# EAGLE schematic New Pendant wiring (EAGLE 6.4)
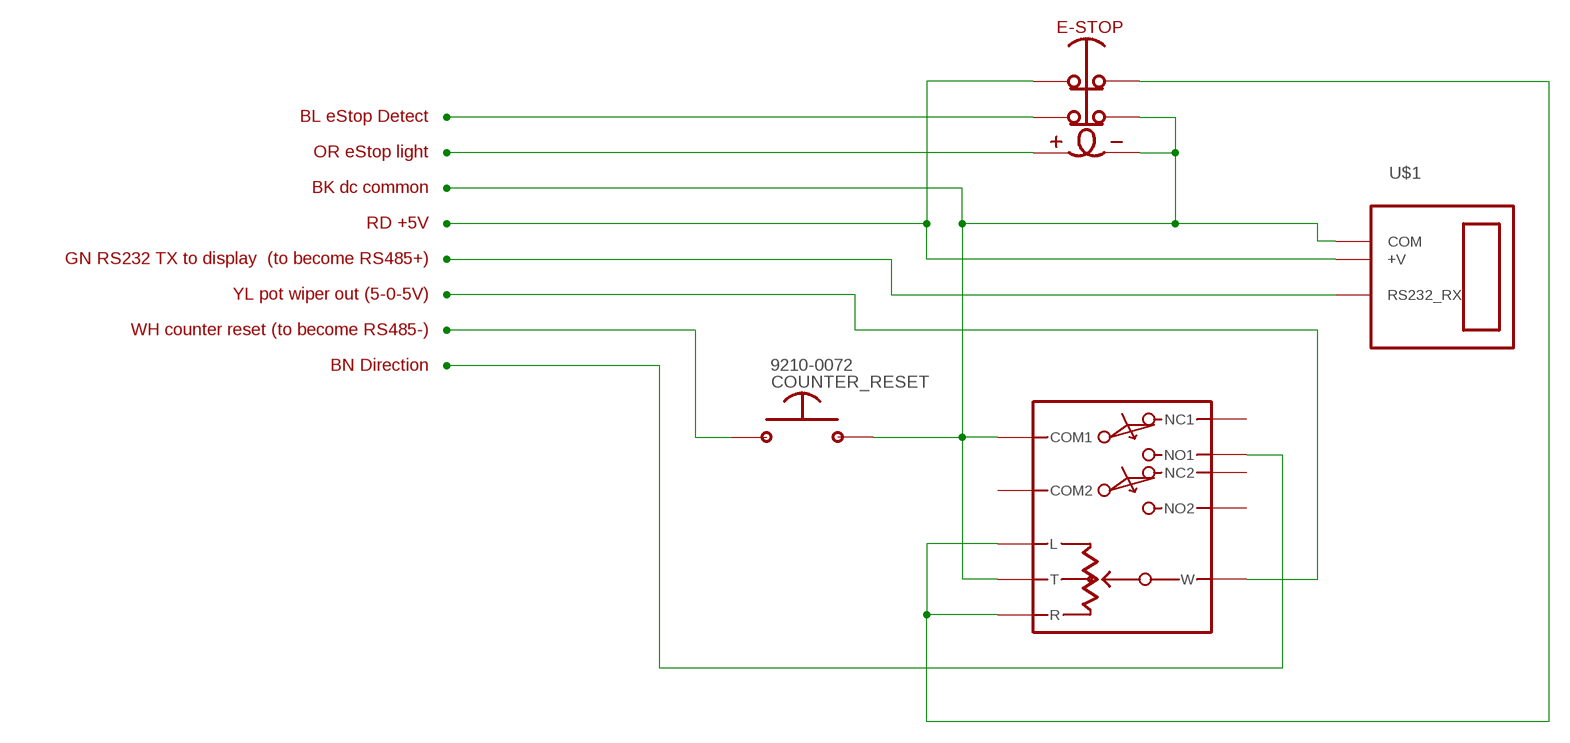
[diagram p0: schematic, sheet 1]

## Parts
COUNTER_RESET  SWITCH_MOM_NO  [BOGUS]
U$1  DISPLAY_COUNTER_ELW_SERIAL  [BOGUS]
U$2  SWITCH_ESTOP_LIGHTED  [BOGUS]
U$3  JOYSTICK_PRO-5  [BOGUS]

## Nets
N$1: U$2.P$5
N$2: COUNTER_RESET.P$2 U$1.P$2(COM) U$2.P$4 U$2.P$6 U$3.P$1(COM1) U$3.P$9(T)
N$3: U$3.P$10(W)
N$4: COUNTER_RESET.P$1
N$5: U$2.P$2
N$6: U$3.P$6(NO1)
N$7: U$1.P$3(RS232_RX)
N$8: U$1.P$1(+V) U$2.P$1
N$9: U$2.P$3 U$3.P$3(L) U$3.P$8(R)
Unconnected: U$3.P$2(COM2) U$3.P$4(NC1) U$3.P$5(NC2) U$3.P$7(NO2)

## Notes on the sheet
- BL eStop Detect
- OR eStop light
- BK dc common
- RD +5V
- GN RS232 TX to display  (to become RS485+)
- YL pot wiper out (5-0-5V)
- WH counter reset (to become RS485-)
- BN Direction

## Library data of the parts
COUNTER_RESET = DougM-SOSI-Wiring-Diagram.rpt:SWITCH_MOM_NO: 9210-0072 Mouser Part #: 850-59-313 Manufacturer Part #: 59-313
U$1 = DougM-SOSI-Wiring-Diagram.rpt:DISPLAY_COUNTER_ELW_SERIAL
U$2 = DougM-SOSI-Wiring-Diagram.rpt:SWITCH_ESTOP_LIGHTED: 9210-0045 Switch, Emergency Stop, w/ #800T-XA4 contact block (old #800H-FRXTQH10RA4) Allen Bradley 800H-FRXTQH2RA4
U$3 = DougM-SOSI-Wiring-Diagram.rpt:JOYSTICK_PRO-5: 9280-0000 PRO5-202.1085 (w/20k center tap potentiometer) Joystick (Master Switch), w/20k center tap potentiometer J. R. Merritt Controls